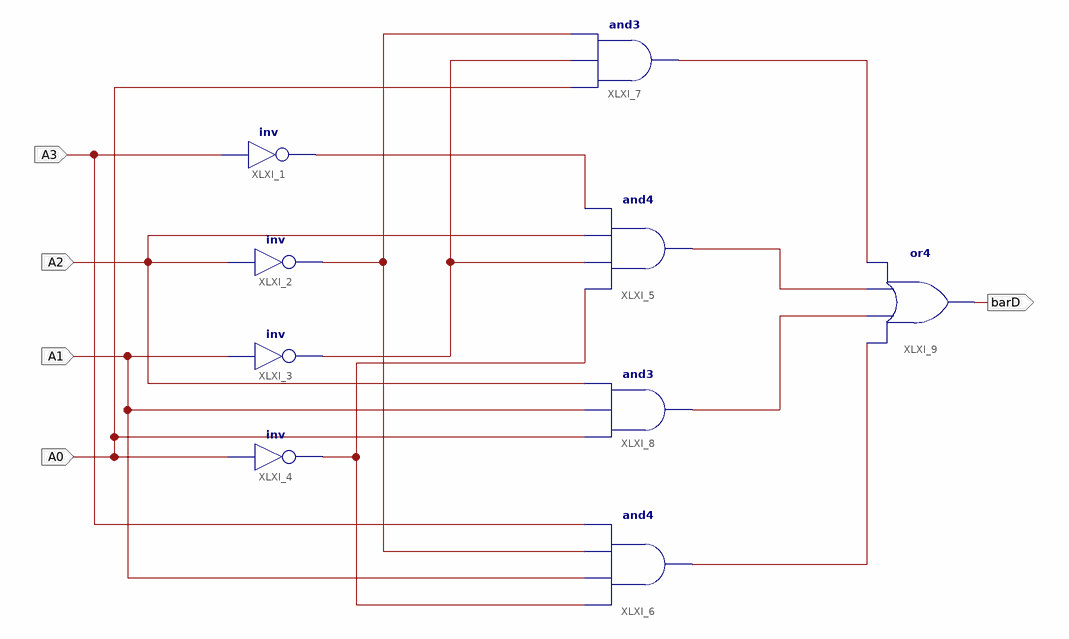
[diagram p0: schematic sheet 1]
// Xilinx ISE schematic fnd4.sch (spartan6) as structural Verilog: 9 symbols, 5 ports
module fnd4 (
  input  A3,
  input  A2,
  input  A1,
  input  A0,
  output barD
);

  wire XLXN_9, XLXN_12, XLXN_14, XLXN_15, XLXN_23, XLXN_24, XLXN_25, XLXN_26;

  not XLXI_1 (XLXN_12, A3);
  not XLXI_2 (XLXN_9, A2);
  not XLXI_3 (XLXN_14, A1);
  not XLXI_4 (XLXN_15, A0);
  and XLXI_5 (XLXN_24, XLXN_15, XLXN_14, A2, XLXN_12);
  and XLXI_6 (XLXN_26, XLXN_15, A1, XLXN_9, A3);
  and XLXI_7 (XLXN_23, A0, XLXN_14, XLXN_9);
  and XLXI_8 (XLXN_25, A0, A1, A2);
  or XLXI_9 (barD, XLXN_26, XLXN_25, XLXN_24, XLXN_23);
endmodule
